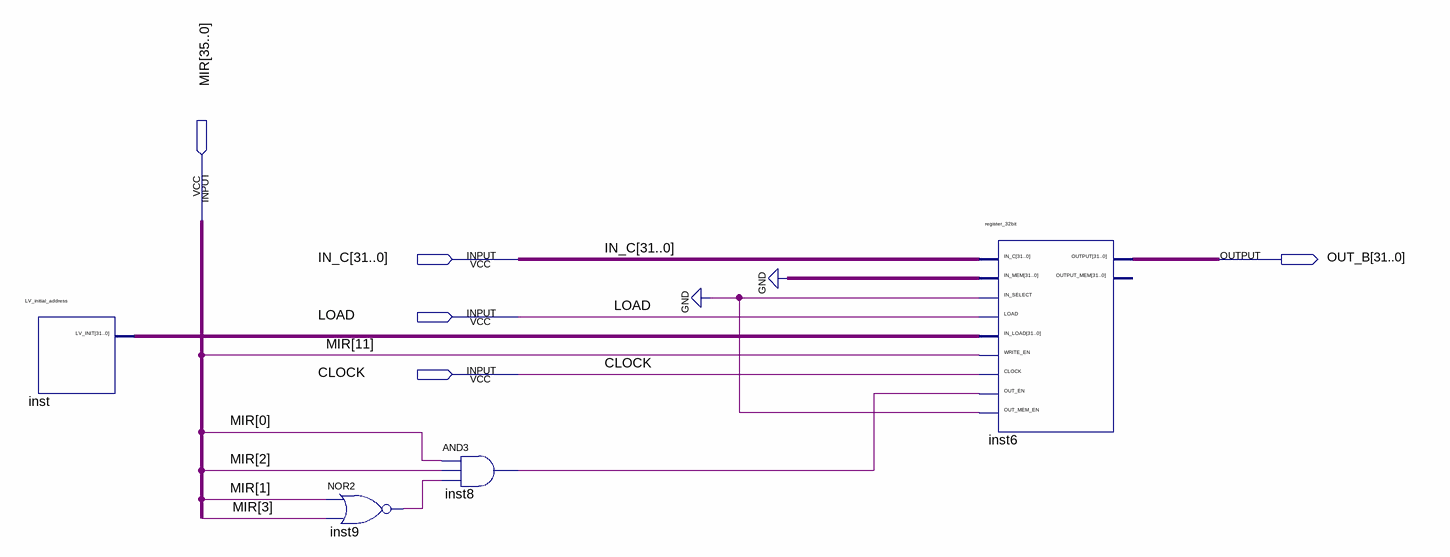
[diagram p0: schematic sheet]
// Quartus schematic LV.bdf as structural Verilog: 4 symbols, 5 pins
module LV (
  input  [35:0] MIR,
  input  [31:0] IN_C,
  input  LOAD,
  input  CLOCK,
  output [31:0] OUT_B
);

  wire inst8_out, inst9_out;
  wire [31:0] inst_lv_init;

  LV_initial_address inst (.LV_INIT(inst_lv_init));
  nor inst9 (inst9_out, MIR[1], MIR[3]);
  and inst8 (inst8_out, MIR[0], MIR[2], inst9_out);
  register_32bit inst6 (
    .IN_LOAD(inst_lv_init), .IN_C(IN_C), .LOAD(LOAD), .IN_MEM({32{1'b0}}), .IN_SELECT(1'b0),
    .WRITE_EN(MIR[11]), .CLOCK(CLOCK), .OUT_EN(inst8_out), .OUT_MEM_EN(1'b0), .OUTPUT(OUT_B));  // open: OUTPUT_MEM
endmodule
